# EAGLE design mixer2_post layout_2 (EAGLE 7.3.0)
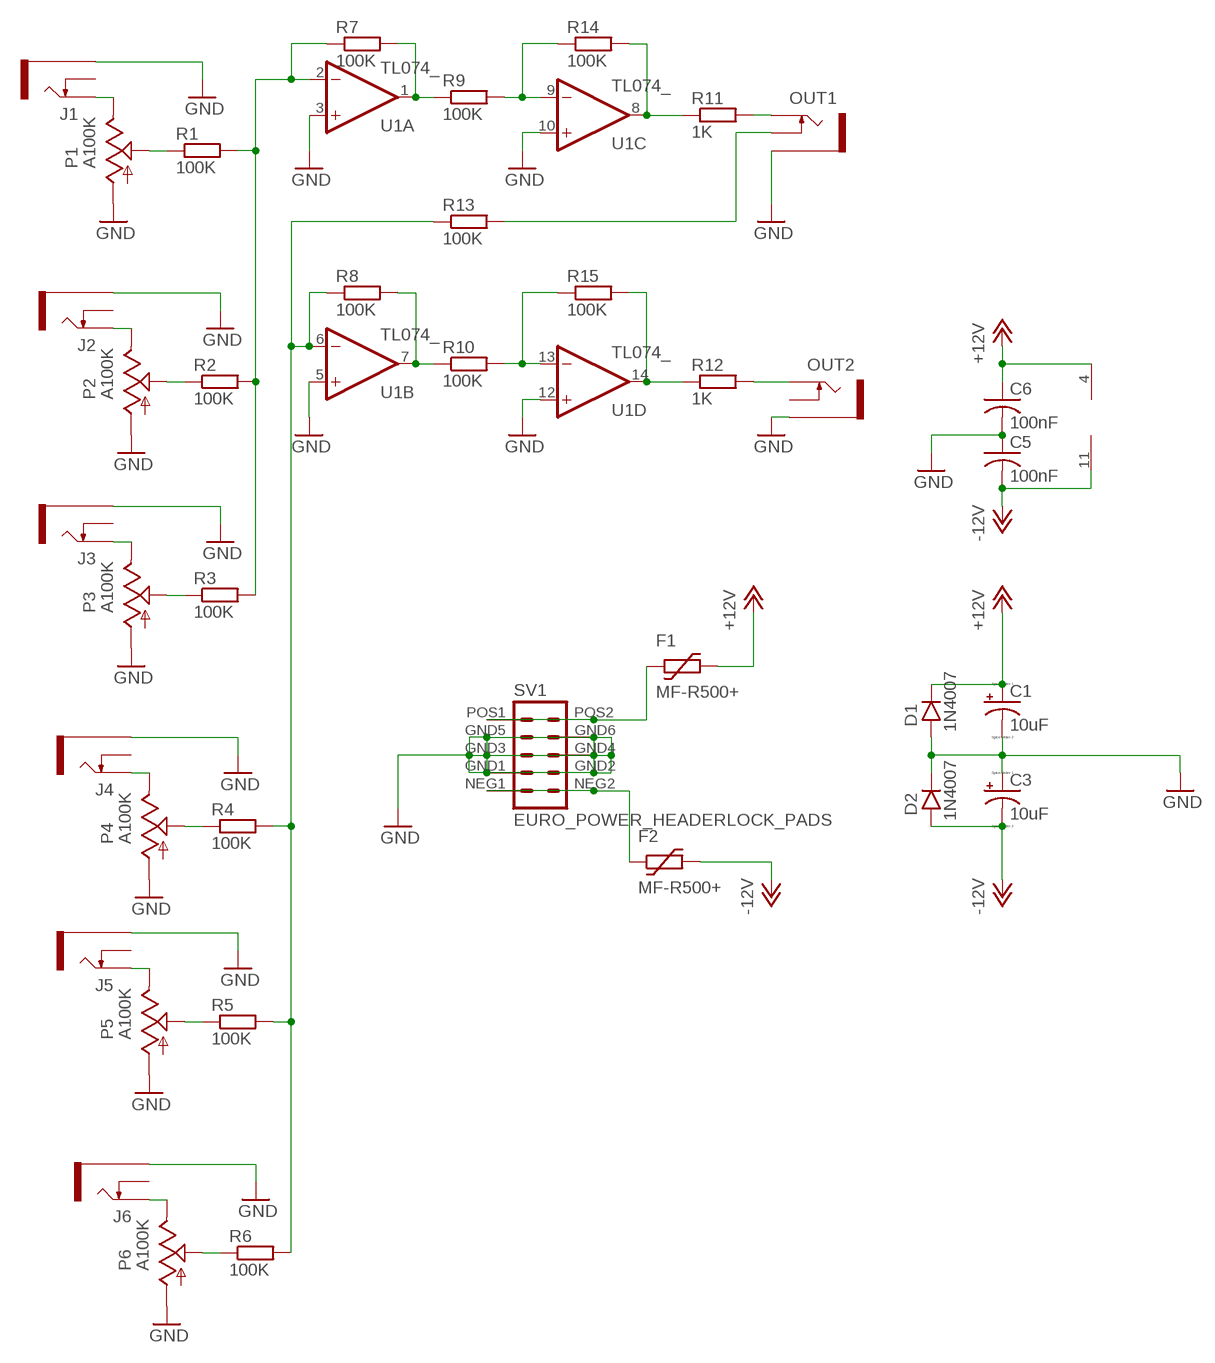
[diagram p0: schematic, sheet 1]

## Parts
C1  10uF  CPOL-USE2.5-7  [E2,5-7]
C3  10uF  CPOL-USE2.5-7  [E2,5-7]
C5  100nF  C-US075-032X103  [C075-032X103]
C6  100nF  C-US075-032X103  [C075-032X103]
D1  1N4007  1N400X.3  [DO41-3]
D2  1N4007  1N400X.3  [DO41-3]
F1  MF-R500+  [BOURNS-MF-R]
F2  MF-R500+  [BOURNS-MF-R]
J1  THONKICONNNEW  [WQP-PJ301M-12_JACK]
J2  THONKICONNNEW  [WQP-PJ301M-12_JACK]
J3  THONKICONNNEW  [WQP-PJ301M-12_JACK]
J4  THONKICONNNEW  [WQP-PJ301M-12_JACK]
J5  THONKICONNNEW  [WQP-PJ301M-12_JACK]
J6  THONKICONNNEW  [WQP-PJ301M-12_JACK]
OUT1  THONKICONNNEW  [WQP-PJ301M-12_JACK]
OUT2  THONKICONNNEW  [WQP-PJ301M-12_JACK]
P1  A100K  9MM_SNAP-IN_POT_  [9MM_SNAP-IN_POT]
P2  A100K  9MM_SNAP-IN_POT_  [9MM_SNAP-IN_POT]
P3  A100K  9MM_SNAP-IN_POT_  [9MM_SNAP-IN_POT]
P4  A100K  9MM_SNAP-IN_POT_  [9MM_SNAP-IN_POT]
P5  A100K  9MM_SNAP-IN_POT_  [9MM_SNAP-IN_POT]
P6  A100K  9MM_SNAP-IN_POT_  [9MM_SNAP-IN_POT]
R1  100K  RESISTOR7MM  [7MM_RESISTOR]
R2  100K  RESISTOR7MM  [7MM_RESISTOR]
R3  100K  RESISTOR7MM  [7MM_RESISTOR]
R4  100K  RESISTOR7MM  [7MM_RESISTOR]
R5  100K  RESISTOR7MM  [7MM_RESISTOR]
R6  100K  RESISTOR7MM  [7MM_RESISTOR]
R7  100K  RESISTOR7MM  [7MM_RESISTOR]
R8  100K  RESISTOR7MM  [7MM_RESISTOR]
R9  100K  RESISTOR7MM  [7MM_RESISTOR]
R10  100K  RESISTOR7MM  [7MM_RESISTOR]
R11  1K  RESISTOR7MM  [7MM_RESISTOR]
R12  1K  RESISTOR7MM  [7MM_RESISTOR]
R13  100K  RESISTOR7MM  [7MM_RESISTOR]
R14  100K  RESISTOR7MM  [7MM_RESISTOR]
R15  100K  RESISTOR7MM  [7MM_RESISTOR]
SV1  EURO_POWER_HEADERLOCK_PADS  [EURO_PWR_HEADER_LOCK]
U1  TL074_  [DIL14]

## Nets
+12V: C1.+ C6.1 D1.C F1.P$2 U1.4(P:V+)
-12V: C3.- C5.2 D2.A F2.P$2 U1.11(P:V-)
GND: C1.- C3.+ C5.1 C6.2 D1.A D2.C J1.P$3_SLEEVE(SLEEVE) J2.P$3_SLEEVE(SLEEVE) J3.P$3_SLEEVE(SLEEVE) J4.P$3_SLEEVE(SLEEVE) J5.P$3_SLEEVE(SLEEVE) J6.P$3_SLEEVE(SLEEVE) OUT1.P$3_SLEEVE(SLEEVE) OUT2.P$3_SLEEVE(SLEEVE) P1.1(A) P2.1(A) P3.1(A) P4.1(A) P5.1(A) P6.1(A) SV1.GND1 SV1.GND2 SV1.GND3 SV1.GND4 SV1.GND5 SV1.GND6 U1.3(A:+IN) U1.5(B:+IN) U1.10(C:+IN) U1.12(D:+IN)
N$1: J2.P$1_TIP(TIP) P2.3(E)
N$2: P2.2(S) R2.1
N$3: J1.P$1_TIP(TIP) P1.3(E)
N$4: P1.2(S) R1.1
N$5: J3.P$1_TIP(TIP) P3.3(E)
N$6: P3.2(S) R3.1
N$7: J4.P$1_TIP(TIP) P4.3(E)
N$8: P4.2(S) R4.1
N$9: J5.P$1_TIP(TIP) P5.3(E)
N$10: P5.2(S) R5.1
N$11: J6.P$1_TIP(TIP) P6.3(E)
N$12: P6.2(S) R6.1
N$13: R1.2 R2.2 R3.2 R7.1 U1.2(A:-IN)
N$15: R8.2 R10.1 U1.7(B:OUT)
N$17: R9.2 R14.1 U1.9(C:-IN)
N$18: OUT1.P$1_TIP(TIP) R11.2
N$22: R12.1 R15.2 U1.14(D:OUT)
N$23: R10.2 R15.1 U1.13(D:-IN)
N$24: R4.2 R5.2 R6.2 R8.1 R13.1 U1.6(B:-IN)
N$25: R11.1 R14.2 U1.8(C:OUT)
N$26: OUT1.P$2_SWITCH(SWITCH) R13.2
N$27: OUT2.P$1_TIP(TIP) R12.2
N$28: R7.2 R9.1 U1.1(A:OUT)
N$31: F2.P$1 SV1.NEG1 SV1.NEG2
N$32: F1.P$1 SV1.POS1 SV1.POS2
Unconnected: J1.P$2_SWITCH(SWITCH) J2.P$2_SWITCH(SWITCH) J3.P$2_SWITCH(SWITCH) J4.P$2_SWITCH(SWITCH) J5.P$2_SWITCH(SWITCH) J6.P$2_SWITCH(SWITCH) OUT2.P$2_SWITCH(SWITCH)

## Library data of the parts
C1 C3 = resistor:CPOL-US: POLARIZED CAPACITOR, American symbol
C5 C6 = resistor:C-US: CAPACITOR, American symbol
D1 D2 = gm-diodes:1N400X: Rectifier Diodes often used in power supply to prevent damage from reverse polarization
F1 F2 = ptc-littlefuse:MF-R500+: http://www.farnell.com/datasheets/1817521.pdf
J1-J6 OUT1 OUT2 = MusicThingModular:THONKICONN: 3.5mm socket for Eurorack modular synths
P1-P6 = MusicThingModular:9MM_SNAP-IN_POT: 9mm vertical snap-in pot, Alpha / Panasonic style
R1-R15 = MusicThingModular:RESISTOR: Standard resistor, various versions
SV1 = MusicThingModular:EURO_POWER_HEADER: Power Header 10 pin power header for Eurorack Power Supplies Variants with fatter pads for easier soldering, and the LOCK variant which has 5mil offset pins to hold the component in place before soldering
U1 = MusicThingModular:TL074: Generic Quad Op Amp

## Board
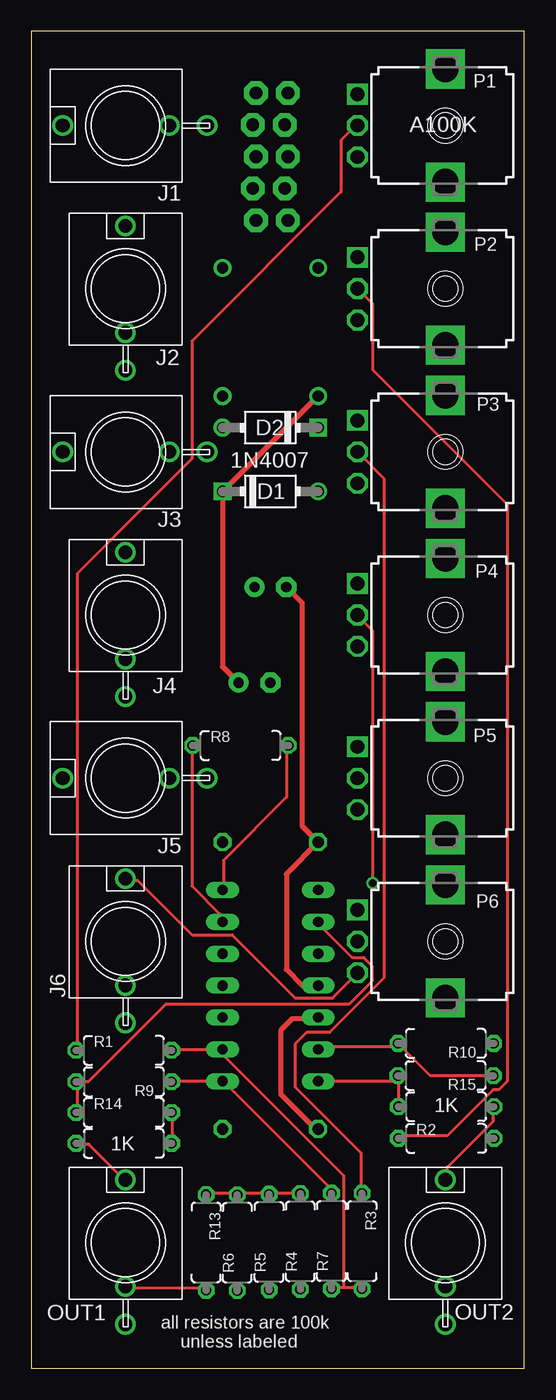
[diagram p1: board, top side]
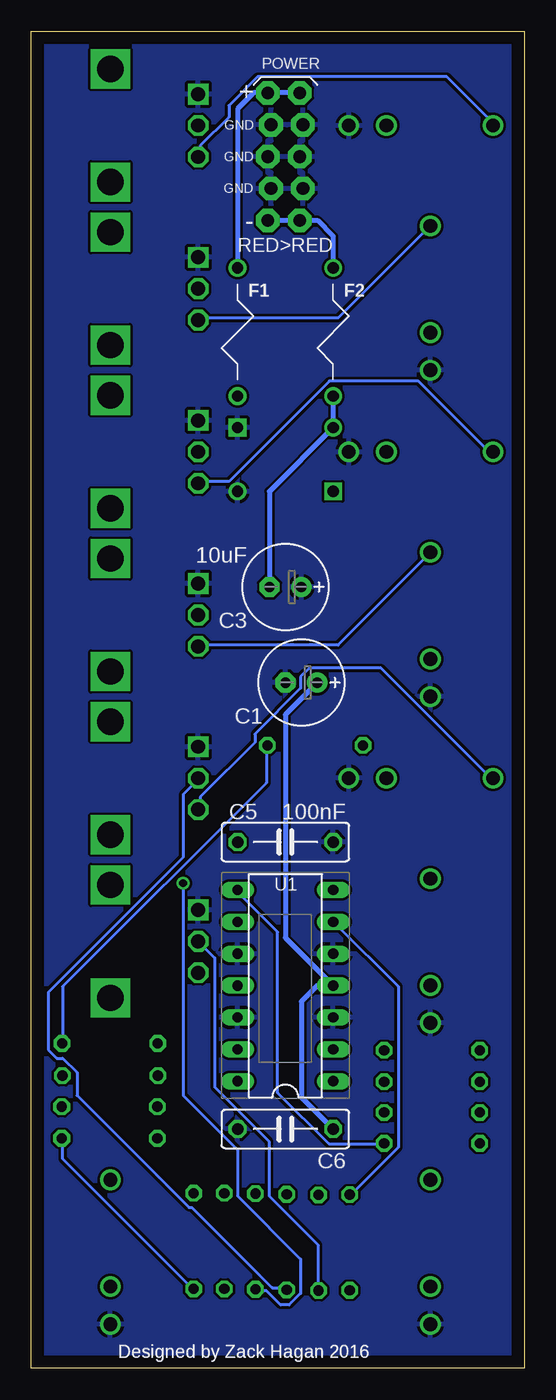
[diagram p2: board, bottom side, seen from below]

Size 39.3 x 106.5 mm. Coordinates in mm from the lower left corner, seen from the top.
Outline: 39.3,0 39.3,106.5 0,106.5 0,0 39.3,0
Copper layers (1*16): Top 0.035mm / dielectric 1.5mm / Bottom 0.035mm
Design rules "default": minimum track width 10mil, minimum drill 24mil, track to track 8mil, track to pad 8mil, pad to pad 8mil, via to via 8mil, smd to smd 8mil, copper to edge 40mil, drill to drill 8mil, minimum pad ring 10mil, minimum via ring 8mil, stop-mask expansion 4mil, vias tented up to drill 0mil, thermal gap 10mil

### Footprints (pad centres in the part's own frame; a part is rotated, then mirrored left to right if it is on the bottom)
E2,5-7 = drill 0.813 pad 1.6: + -1.27,0 | drill 0.813 pad 1.6 octagon: - 1.27,0
C075-032X103 = drill 0.914 octagon: 1 -3.81,0; 2 3.81,0
DO41-3 = drill 0.9: A 3.81,0 | drill 0.9 square: C -3.81,0
BOURNS-MF-R = drill 0.9: P$1 -5.105,0; P$2 5.105,0
WQP-PJ301M-12_JACK = drill 1.1: P$1_TIP 0,5; P$2_SWITCH 0,-3.5; P$3_SLEEVE 0,-6.5
9MM_SNAP-IN_POT = drill 1.1 square: 1 -2.5,-7 | drill 1.1 octagon: 2 0,-7; 3 2.5,-7 | drill 2.1 square: CHASSIS1 -4.5,0; CHASSIS2 4.5,0
7MM_RESISTOR = drill 0.813 octagon: 1 -3.81,0; 2 3.81,0
EURO_PWR_HEADER_LOCK = drill 1.016 pad 1.88 octagon: GND1 -2.54,1.143; GND2 -2.54,-1.397; GND3 0,1.397; GND4 0,-1.143; GND5 2.54,1.143; GND6 2.54,-1.397; NEG1 -5.08,1.397; NEG2 -5.08,-1.143; POS1 5.08,1.397; POS2 5.08,-1.143
DIL14 = drill 0.813 long: 1 -7.62,-3.81; 2 -5.08,-3.81; 3 -2.54,-3.81; 4 0,-3.81; 5 2.54,-3.81; 6 5.08,-3.81; 7 7.62,-3.81; 8 7.62,3.81; 9 5.08,3.81; 10 2.54,3.81; 11 0,3.81; 12 -2.54,3.81; 13 -5.08,3.81; 14 -7.62,3.81

### Placement (x,y rotation side)
C1  17.78,54.61 180 bottom
C3  19.05,62.23 180 bottom
C5  19.05,41.91 180 bottom
C6  19.05,19.05 180 bottom
D1  19.05,69.85 0 top
D2  19.05,74.93 180 top
F1  22.86,82.55 270 bottom
F2  15.24,82.55 270 bottom
J1  7.5,99 90 top
J2  7.5,86 0 top
J3  7.5,73 90 top
J4  7.5,60 0 top
J5  7.5,47 90 top
J6  7.5,34 0 top
OUT1  7.5,10 0 top
OUT2  33,10 0 top
P1  33,99 270 top
P2  33,86 270 top
P3  33,73 270 top
P4  33,60 270 top
P5  33,47 270 top
P6  33,34 270 top
R1  7.37,25.32 0 top
R2  33.07,18.31 0 top
R3  26.36,10.12 270 top
R4  21.44,10.09 90 top
R5  18.95,10.04 90 top
R6  16.41,9.99 90 top
R7  23.92,10.12 90 top
R8  16.67,49.61 0 top
R9  7.37,22.81 180 top
R10  33.04,25.87 180 top
R11  7.37,17.91 180 top
R12  33.07,20.83 0 top
R13  13.93,10.01 270 top
R14  7.37,20.37 0 top
R15  33.02,23.3 180 top
SV1  19.05,96.52 90 bottom
U1  19.05,30.48 90 bottom

### Tracks (layer width: path | path; a pad name or v marks a point on that pad's centre or on a via)
+12V
  Top 0.406: F1.P$2 22.84,77.44 D1.C 15.24,55.88 C1.+
  Bottom 0.406: C1.+ 19.05,52.07 19.05,34.29 U1.4 16.51,30.48 17.78,29.21 17.78,21.59 C6.1
-12V
  Top 0.406: C3.- 21.59,60.96 21.59,43.18 C5.2 20.32,39.37 20.32,31.75 21.59,30.48 U1.11
  Bottom 0.406: F2.P$2 D2.A 20.32,69.85 C3.-
GND
  Top 0.406: C6.2 22.65,19.05 19.9,21.8 19.9,26.95 20.8,27.85 22.77,27.85 U1.12
  pour Bottom (isolate 0.12): 1.27,106.68 0,106.68 0,0 39.37,0 39.37,106.68
N$1
  Bottom 0.254: P2.3 25.83,83.67 14.86,83.67 7.54,90.98 J2.P$1_TIP
N$2
  Top 0.254: R2.1 29.26,18.52 33.15,18.52 36.8,22.17 37.26,22.17 37.95,22.86 37.95,68.81 27.2,79.55 27.2,84.81 26.06,85.95 P2.2
N$3
  Bottom 0.254: P1.3 25.83,96.7 25.83,97.38 23.55,99.67 23.55,100.58 21.26,102.87 6.17,102.87 2.52,99.21 J1.P$1_TIP
N$4
  Top 0.254: R1.1 3.66,25.38 3.66,63.32 12.8,72.47 12.8,81.84 24.69,93.73 24.69,97.84 25.83,98.98 P1.2
N$5
  Bottom 0.254: P3.3 25.83,70.64 23.55,70.64 15.54,78.64 8.46,78.64 2.97,73.15 2.52,73.15 J3.P$1_TIP
N$6
  Top 0.254: R3.1 26.29,13.95 26.29,17.14 21.03,22.4 21.03,25.83 21.95,26.75 23.77,26.75 28.12,31.09 28.12,70.87 26.06,72.92 P3.2
N$7
  Bottom 0.254: P4.3 25.83,57.61 14.86,57.61 7.54,64.92 J4.P$1_TIP
N$8  (via drill 0.61)
  Top 0.254: v27.2,38.63 27.2,58.75 26.06,59.89 P4.2
  Bottom 0.254: v27.2,38.63 27.2,21.72 22.86,17.37 22.86,13.72 17.83,8.69 17.83,5.94 18.75,5.03 19.43,5.03 20.57,6.17 21.26,6.17 R4.1
N$9
  Bottom 0.254: P5.3 25.83,44.58 25.83,45.49 21.49,49.84 21.49,50.52 17.83,54.18 17.83,55.09 17.14,55.78 11.43,55.78 2.52,46.86 J5.P$1_TIP
N$10
  Bottom 0.254: R5.1 18.97,6.4 20.12,6.4 26.52,12.8 26.75,12.8 35.66,21.72 35.66,23.55 36.8,24.69 37.26,24.69 37.95,25.38 37.95,29.95 27.2,40.69 27.2,45.72 26.06,46.86 P5.2
N$11
  Top 0.254: P6.3 25.83,31.32 24,29.49 21.03,29.49 16,34.52 12.8,34.52 8.46,38.86 7.54,38.86 J6.P$1_TIP
N$12
  Bottom 0.254: R6.1 16.46,6.4 16.46,9.83 20.34,13.72 20.34,18.06 24.69,22.4 24.69,32.69 25.83,33.83 P6.2
N$13
  Top 0.254: R1.2 11.2,25.38 15.09,25.38 U1.2 15.32,25.38 15.32,24.92 24.92,15.32 24.92,6.4 | 24.92,6.4 26.29,6.4 R3.2 | 24.92,6.4 24,6.4 R7.1
  Bottom 0.254: R2.2 36.8,18.29 36.8,16.69 26.52,6.4 R3.2
N$15
  Top 0.254: U1.7 15.32,38.18 15.32,40.46 20.34,45.49 20.34,49.61 R8.2
  Bottom 0.254: R10.1 36.8,26.06 36.8,30.4 20.57,46.63 20.57,49.61 R8.2
N$17
  Top 0.254: R14.1 3.66,20.57 3.66,22.63 R9.2 3.66,22.86 4.57,22.86 10.74,29.03 25.38,29.03 27.2,30.86 27.2,32 26.52,32.69 25.6,32.69 22.86,35.43 U1.9
N$18
  Top 0.254: R11.2 3.66,17.83 4.57,17.83 7.32,15.09 OUT1.P$1_TIP
N$22
  Top 0.254: 29.26,22.86 29.26,23.09 R15.2 29.26,22.86 | 29.26,22.86 29.26,21.03 R12.1 | 29.26,22.86 U1.14
N$23
  Top 0.254: U1.13 22.86,25.6 28.8,25.6 29.03,25.83 R10.2 29.26,25.83 31.77,23.32 36.8,23.32 R15.1
N$24
  Top 0.254: R13.1 13.95,13.95 16.23,13.95 R6.2 16.46,13.95 18.75,13.95 R5.2 18.97,13.95 21.26,13.95 R4.2 | U1.6 15.09,35.66 15.09,36.12 12.8,38.41 12.8,49.61 R8.1
  Bottom 0.254: R13.1 13.72,13.95 10.06,17.6 10.06,30.4 15.09,35.43 U1.6
N$25
  Top 0.254: R11.1 11.2,18.06 11.2,20.34 R14.2
  Bottom 0.254: U1.8 22.86,37.95 19.66,34.75 19.66,21.95 15.54,17.83 11.2,17.83 R11.1
N$26
  Top 0.254: R13.2 13.72,6.4 7.54,6.4 OUT1.P$2_SWITCH
N$27
  Top 0.254: R12.2 36.8,20.8 36.8,19.66 33.15,16 33.15,15.09 OUT2.P$1_TIP
N$28
  Top 0.254: R7.2 23.77,13.95 23.77,14.4 15.32,22.86 U1.1 11.2,22.86 R9.1
N$31
  Bottom 0.406: SV1.NEG1 SV1.NEG2 16.51,91.44 15.24,90.17 F2.P$1
N$32
  Bottom 0.406: SV1.POS2 SV1.POS1 21.59,101.6 22.86,100.33 F1.P$1

### Text on the board
tPlace: all resistors are 100k / unless labeled
bPlace: Designed by Zack Hagan 2016 | Designed by Zack Hagan 2016